# EAGLE design cam_switch (EAGLE 9.6.2)
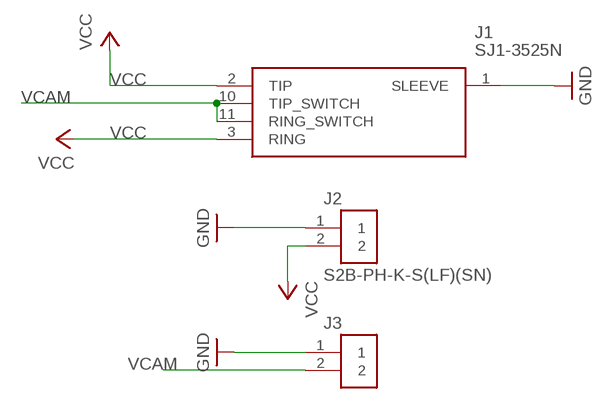
[diagram p0: schematic, sheet 1]

## Parts
J1  SJ1-3525N  [SJ13525N]
J2  S2B-PH-K-S(LF)(SN)  [S2B-PH-K-S(LF)(SN)]
J3  S2B-PH-K-S(LF)(SN)  [S2B-PH-K-S(LF)(SN)]

## Nets
GND: J1.1(SLEEVE) J2.1 J3.1
VCAM: J1.10(TIP_SWITCH) J1.11(RING_SWITCH) J3.2
VCC: J1.2(TIP) J1.3(RING) J2.2

## Library data of the parts
J1 = SamacSys_Parts:SJ1-3525N: 3.5 mm, Stereo, Right Angle, Through Hole, 3 Conductors, 2 Internal Switches, Audio Jack Connector Source: Datasheet <https://www.cuidevices.com/product/resource/pdf/sj1-352xn.pdf>; DESCRIPTION: 3.5 mm, Stereo, Right Angle, Through Hole, 3 Conductors, 2 Internal Switches, Audio Jack Connector; HEIGHT: mm; MANUFACTURER_NAME: CUI Devices; MANUFACTURER_PART_NUMBER: SJ1-3525N
J2 J3 = Connectors:S2B-PH-K-S(LF)(SN): CONN HEADER R/A 2POS 2MM Manufacturer's datasheet <http://www.jst-mfg.com/product/pdf/eng/ePH.pdf>; CREATED_BY: PCBLayout.com; DIGI_KEY_PART_NUMBER: 455-1719-ND; MANUFACTURER: JST Sales America Inc.; MPN: S2B-PH-K-S(LF)(SN)

## Board
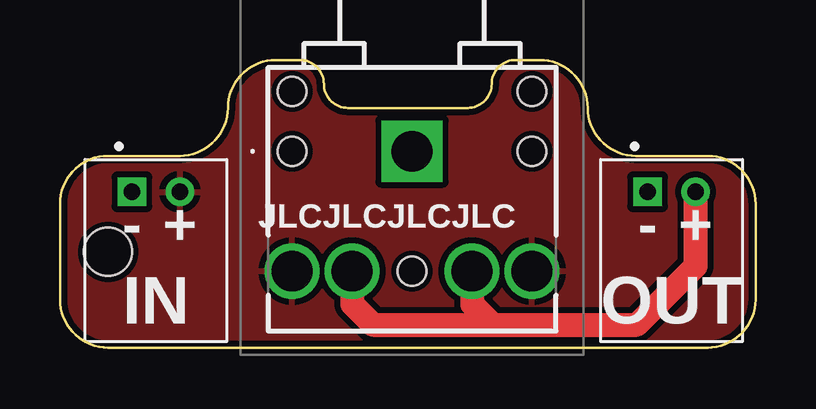
[diagram p1: board, top side]
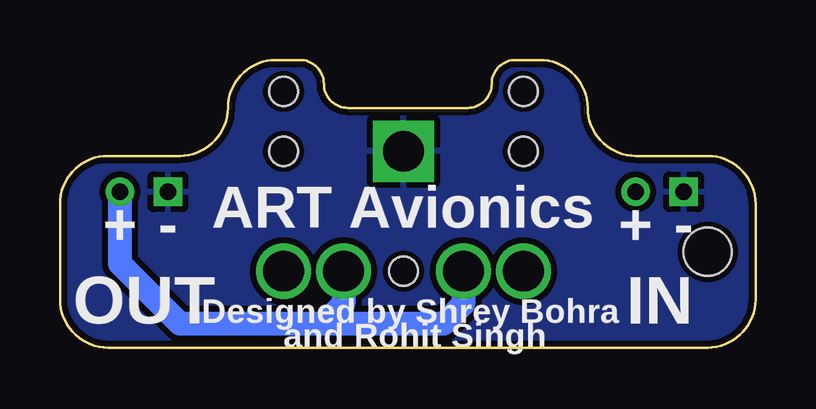
[diagram p2: board, bottom side, seen from below]

Size 29 x 12 mm. Coordinates in mm from the lower left corner, seen from the top.
Outline: 7,10 arc-90 9,12 10,12 arc-90 11,11 arc90 12,10 17,10 arc90 18,11 arc-90 19,12 20,12 arc-90 22,10 arc90 24,8 27,8 arc-90 29,6 29,2 arc-90 27,0 2,0 arc-90 0,2 0,6 arc-90 2,8 5,8 arc90 7,10
Copper layers (1*16): Top 0.035mm / dielectric 1.6mm / Bottom 0.035mm
Design rules "jlcpcb-2layers *": minimum track width 5mil, minimum drill 0.3mm, track to track 5mil, track to pad 5mil, pad to pad 5mil, via to via 5mil, smd to smd 5mil, copper to edge 0.2mm, drill to drill 6mil, minimum pad ring 10mil, minimum via ring 3mil, stop-mask expansion 4mil, vias tented up to drill 0mil, thermal gap 10mil
Holes 2 mm at 2,4

### Footprints (pad centres in the part's own frame; a part is rotated, then mirrored left to right if it is on the bottom)
SJ13525N = drill 1.7 pad 2.55 square: 1 0,0 | drill 1.7 pad 2.3: 2 -5,-5; 3 5,-5; 10 -2.5,-5; 11 2.5,-5 | hole 1.2: -5,2.5; -5,0; 0,-5; 5,0; 5,2.5
S2B-PH-K-S(LF)(SN) = drill 0.7 square: 1 -1,0 | drill 0.7: 2 1,0

### Placement (x,y rotation side)
J1  14.68,8.19 0 top
J2  4,6.5 0 top
J3  25.5,6.5 0 top

### Tracks (layer width: path | path; a pad name or v marks a point on that pad's centre or on a via)
GND
  pour Bottom (isolate 0.25): -1,3 -1,17 30,17 31,16 31,-10 -1,-10
VCAM
  Top 1: J1.11 17.18,1.82 18.05,0.95 | 18.05,0.95 24.05,0.95 26.5,3.4 J3.2 | J1.10 12.18,1.82 13.05,0.95 18.05,0.95
  Bottom 1: J1.11 17.18,1.82 18,1 | 18,1 24,1 26.5,3.5 J3.2 | J1.10 12.18,1.82 13,1 18,1
VCC
  pour Top (isolate 0.25): -2,-1 32,-1 32,18 -2,18

### Text on the board
tPlace: JLCJLCJLCJLC | - | + | - | + | IN | OUT
bPlace: ART Avionics | - | + | - | + | IN | OUT | Designed by Shrey Bohra / and Rohit Singh